# Altium schematic sheet SPEED-CONTROLER.SchDoc
size A4
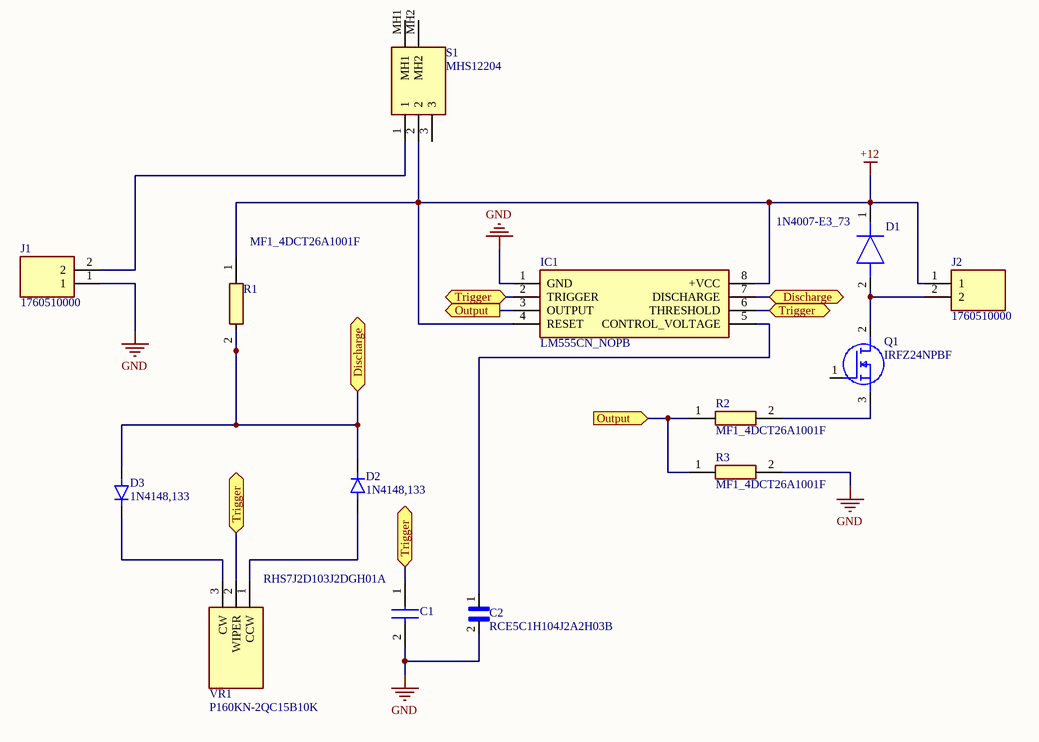
[diagram p0: SPEED-CONTROLER.SchDoc]

## Parts
C1  RHS7J2D103J2DGH01A  [RHS7J2D103J2DGH01A]
C2  RCE5C1H104J2A2H03B  [CAP_RCE5C1H104J2A2H03B]
D1  1N4007-E3_73  [DIOAD1405W86L465D235]
D2  1N4148,133  [DIOAD753W49L380D172B]
D3  1N4148,133  [DIOAD753W49L380D172B]
IC1  LM555CN_NOPB  [DIP794W53P254L959H508Q8N]
J1  1760510000  [1760510000]
J2  1760510000  [1760510000]
Q1  IRFZ24NPBF  [TO254P469X1042X1967-3P]
R1  MF1_4DCT26A1001F  [RESAD1630W60L710D230]
R2  MF1_4DCT26A1001F  [RESAD1630W60L710D230]
R3  MF1_4DCT26A1001F  [RESAD1630W60L710D230]
S1  MHS12204  [MHS12204]
VR1  P160KN-2QC15B10K  [P160KN2QC15B10K]

## Ports
Discharge (bidir), Output (in), Output (out), Trigger (bidir)

## Nets
+12: D1.1(K) IC1.4(RESET) IC1.8(+VCC) J2.1 R1.1 S1.2
GND: C1.2 C2.2 IC1.1(GND) J1.1 R3.2
Discharge: D2.K D3.A IC1.7(DISCHARGE) R1.2 ; port Discharge
Output: IC1.3(OUTPUT) R2.1 R3.1 ; port Output
Trigger: C1.1 IC1.2(TRIGGER) IC1.6(THRESHOLD) VR1.2(WIPER) ; port Trigger
NetC2_1: C2.1 IC1.5(CONTROL_VOLTAGE)
NetD1_2: D1.2(A) J2.2 Q1.2(D)
NetD2_A: D2.A VR1.1(CCW)
NetD3_K: D3.K VR1.3(CW)
NetJ1_2: J1.2 S1.1
NetQ1_3: Q1.3(S) R2.2

Not connected (* = marked no-connect by the designer): Q1 1(G); S1 3 MH1 MH2

## Library data of the parts
C1 = RHS7J2D103J2DGH01A: Capacitor; Manufacturer_Name: Murata Electronics; Datasheet Link: https://search.murata.co.jp/Ceramy/image/img/A01X/G101/ENG/RHS_UNJ_200V_500V_E.pdf; Height: 3.3mm; Manufacturer_Part_Number: RHS7J2D103J2DGH01A; Mouser Part Number: 81-RHS7J2D103J2DGH1A; Mouser Price/Stock: https://www.mouser.co.uk/ProductDetail/Murata-Electronics/RHS7J2D103J2DGH01A?qs=xhbEVWpZdWd37zfbUob1kg%3D%3D; Arrow Part Number: RHS7J2D103J2DGH01A; Arrow Price/Stock: https://www.arrow.com/en/products/rhs7j2d103j2dgh01a/murata-manufacturing?region=nac
C2 = RCE5C1H104J2A2H03B: Multilayer Ceramic Capacitors MLCC - Leaded; Package: None; Price: None; Value: *; MP: RCE5C1H104J2A2H03B; Availability: Unavailable
D1 = 1N4007-E3_73: Diode; Manufacturer_Name: Vishay; Manufacturer_Part_Number: 1N4007-E3/73; Datasheet Link: https://mouser.componentsearchengine.com/Datasheets/2/1N4007-E3_73.pdf; Mouser Part Number: 625-1N4007-E3/73; Mouser Price/Stock: https://www.mouser.co.uk/ProductDetail/Vishay-General-Semiconductor/1N4007-E3-73?qs=N4vtoAxH%2FSqT3Ng3e4K0Gw%3D%3D; Arrow Part Number: 1N4007-E3/73; Arrow Price/Stock: https://www.arrow.com/en/products/1n4007-e373/vishay?utm_currency=USD&region=europe
D2 D3 = 1N4148: Diode Standard 75V 200mA Surface Mount SOD-523F; MF: ON Semiconductor; SnapEDA_Link: https://www.snapeda.com/parts/1N4148/Onsemi/view-part/?ref=snap; Package: AXIAL LEAD-2 ON Semiconductor; Value: *; MP: 1N4148; Check_prices: https://www.snapeda.com/parts/1N4148/Onsemi/view-part/?ref=eda
IC1 = LM555CN_NOPB: Integrated Circuit; Manufacturer_Name: Texas Instruments; Manufacturer_Part_Number: LM555CN/NOPB; Datasheet Link: https://datasheet.datasheetarchive.com/originals/distributors/Datasheets-SFU2/DSASFU100035550.pdf; Height: 5.08mm; Mouser Part Number: 926-LM555CN/NOPB; Mouser Price/Stock: https://www.mouser.co.uk/ProductDetail/Texas-Instruments/LM555CN-NOPB?qs=QbsRYf82W3GjZpQL%2FakZOg%3D%3D; Arrow Part Number: LM555CN/NOPB; Arrow Price/Stock: https://www.arrow.com/en/products/lm555cnnopb/texas-instruments?utm_currency=USD&region=nac
J1 J2 = 1760510000: Connector; Manufacturer_Name: Weidmuller; Datasheet Link: http://catalog.weidmueller.com/createDatasheetForMobile.do?ordernumber=1760510000&scope1=1&scope2=1&localeId=en; Height: 10mm; Manufacturer_Part_Number: 1760510000; Mouser Part Number: 470-1760510000; Mouser Price/Stock: https://www.mouser.co.uk/ProductDetail/Weidmuller/1760510000?qs=BTG2th8YmhTa8qcglSF3eg%3D%3D
Q1 = IRFZ24NPBF: MOSFET (N-Channel); Manufacturer_Name: Infineon; Datasheet Link: https://www.mouser.com/datasheet/2/196/irfz24npbf-1227512.pdf; Height: 4.69mm; Manufacturer_Part_Number: IRFZ24NPBF; Mouser Part Number: 942-IRFZ24NPBF; Mouser Price/Stock: https://www.mouser.co.uk/ProductDetail/Infineon-Technologies/IRFZ24NPBF?qs=9%252BKlkBgLFf0TQgSTtY4J0g%3D%3D; Arrow Part Number: IRFZ24NPBF; Arrow Price/Stock: https://www.arrow.com/en/products/irfz24npbf/infineon-technologies-ag?utm_currency=USD&region=europe
R1-R3 = MF1_4DCT26A1001F: Resistor; Manufacturer_Name: KOA Speer; Manufacturer_Part_Number: MF1/4DCT26A1001F; Datasheet Link: https://componentsearchengine.com/Datasheets/1/MF1_4DCT26A1001F.pdf; Mouser Part Number: 660-MF1/4DCT26A1001F; Mouser Price/Stock: https://www.mouser.co.uk/ProductDetail/KOA-Speer/MF1-4DCT26A1001F?qs=wVGympPcmnD9Oav1Pii0SQ%3D%3D
S1 = MHS12204: Switch; Manufacturer_Name: TE Connectivity; Datasheet Link: https://www.te.com/commerce/DocumentDelivery/DDEController?Action=srchrtrv&DocNm=1825255&DocType=Customer+Drawing&DocLang=English&DocFormat=pdf&PartCntxt=1825255-1; Height: 12mm; Manufacturer_Part_Number: MHS12204; Mouser Part Number: 506-MHS12204; Mouser Price/Stock: https://www.mouser.co.uk/ProductDetail/TE-Connectivity-Alcoswitch/MHS12204?qs=x%2FgbKjZ2T%2FPUluB%2FWhqq0Q%3D%3D; Arrow Part Number: MHS12204; Arrow Price/Stock: https://www.arrow.com/en/products/mhs12204/te-connectivity?region=nac
VR1 = P160KN-2QC15B10K: Variable Resistor; Manufacturer_Name: TT Electronics; Datasheet Link: https://www.ttelectronics.com/TTElectronics/media/ProductFiles/Datasheet/P160.pdf; Height: 21mm; Manufacturer_Part_Number: P160KN-2QC15B10K; Mouser Part Number: 374-P160KN-2QC15B10K; Mouser Price/Stock: https://www.mouser.co.uk/ProductDetail/BI-Technologies-TT-Electronics/P160KN-2QC15B10K?qs=VOMQJJE%252BBNnCK26iGn%2FVdQ%3D%3D